# Altium project i.MX6_SoM.PrjPcb
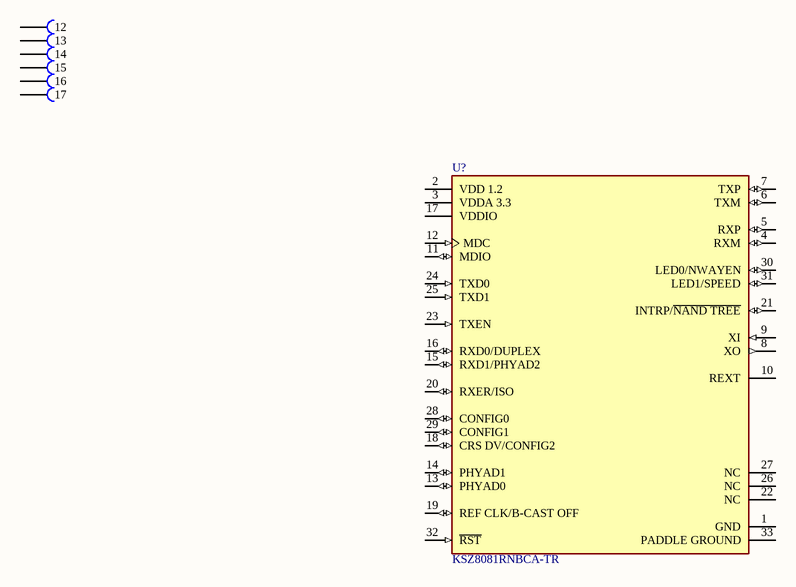
[diagram p0: Ethernet.SchDoc]
6 sheets, 25 parts. Net scope: global (net labels, ports and power ports of the same name join across sheets).
Board files: i.MX6_SoM_BRD.PcbDoc, i.MX6_SoM_PNL.PcbDoc
Sheets:
  Ethernet.SchDoc
  SDRAM.SchDoc
  NAND.SchDoc
  EEPROM.SchDoc
  PMIC.SchDoc
  SUPERVISOR.SchDoc

## Sheet Ethernet.SchDoc
size A4; PageSetup: Record=PageOptions|CenterHorizontal=False|CenterVertical=False|PrintScale=0.95|XCorrection=0.00|YCorrection=0.00|PrintKind=1|BorderSize=5000000|LeftOffset=0|BottomOffset=0|Orientation=1|PaperLength=1000|PaperWidth=1000|Scale=100|PaperSource=15|PrintQuality=600|MediaType=1|DitherType=10|PaperKind=A4|PrintScaleMode=1; Organization: My Company; Address1: Address Line 1; Address2: Address Line 2; Address3: Address Line 3; Address4: Address Line 4; SheetNumber: 1; SheetTotal: 7

### Parts
(Parts that share a designator on the sheet are numbered #1, #2 ... from top to bottom, then left to right.)
i.MX?#1  i.MX6_SoM  [i.MX6_SoM]  (value not drawn)  (part L of 159)  (no BOM)
i.MX?#2  i.MX6_SoM  [i.MX6_SoM]  (value not drawn)  (part M of 159)  (no BOM)
i.MX?#3  i.MX6_SoM  [i.MX6_SoM]  (value not drawn)  (part N of 159)  (no BOM)
i.MX?#4  i.MX6_SoM  [i.MX6_SoM]  (value not drawn)  (part O of 159)  (no BOM)
i.MX?#5  i.MX6_SoM  [i.MX6_SoM]  (value not drawn)  (part P of 159)  (no BOM)
i.MX?#6  i.MX6_SoM  [i.MX6_SoM]  (value not drawn)  (part Q of 159)  (no BOM)
U?#1  KSZ8081RNBCA-TR  [FP-QFN55-32LD-PL-5-MFG]

### Nets

Not connected (* = marked no-connect by the designer): i.MX?#1 12; i.MX?#2 13; i.MX?#3 14; i.MX?#4 15; i.MX?#5 16; i.MX?#6 17; U?#1 1(GND) 2(VDD_1.2) 3(VDDA_3.3) 4(RXM) 5(RXP) 6(TXM) 7(TXP) 8(XO) 9(XI) 10(REXT) 11(MDIO) 12(MDC) 13(PHYAD0) 14(PHYAD1) 15(RXD1/PHYAD2) 16(RXD0/DUPLEX) 17(VDDIO) 18(CRS_DV/CONFIG2) 19(REF_CLK/B-CAST_OFF) 20(RXER/ISO) 21(INTRP/~{NAND_TREE}) 22(NC) 23(TXEN) 24(TXD0) 25(TXD1) 26(NC) 27(NC) 28(CONFIG0) 29(CONFIG1) 30(LED0/NWAYEN) 31(LED1/SPEED) 32(~{RST}) 33(PADDLE_GROUND)

### Notes on the sheet
- Title:
- Author:
- Approved:
- Size:
- Date:
- Git Hash:
- A4
- Prj:
- SW Version:
- Variant:
- Edited:
- CONFIDENTIAL
- File:

### Library data of the parts
U?#1 = CMP-06281-000011-1: IC TRANSCEIVER FULL 1/1 32QFN; Manufacturer: Microchip; Standoff Height: 0mm; Simplex Duplex: Full Duplex; Number Of Channels: 1; Data Rate: 100Mbits/s; Max Supply Voltage: 3.465V; Min Supply Voltage: 1.71V; Nominal Supply Current: 20-47mA; Interface: Ethernet,Other; Max Junction Temp: +125°C; Device Class L2: Interface ICs; Category: IC; Temperature: to +125°C; RoHS: TRUE; Mouser Description: Ethernet ICs 10/100 PHY,  0.11u; Package: QFN55-32LD-PL-5; ComponentLink2URL: http://ww1.microchip.com/downloads/en/DeviceDoc/00002202C.pdf; Digikey Description: IC TRANSCEIVER FULL 1/1 32QFN; Height: 1mm; Lead Free: Yes; Temperature Range High: +125°C; Octopart: https://octopart.com/ksz8081rnbca-tr-microchip-66799962; Device Class L1: Integrated Circuits (ICs); Ambient Temperature Range Low: 0°C; Automotive: No; ComponentLink2Description: Datasheet; Ambient Temperature Range High: +70°C; Device Class L3: Ethernet Interface ICs; Manufacturer Part Number: KSZ8081RNBCA-TR

## Sheet SDRAM.SchDoc
size A4; PageSetup: Record=PageOptions|CenterHorizontal=False|CenterVertical=False|PrintScale=0.95|XCorrection=0.00|YCorrection=0.00|PrintKind=1|BorderSize=5000000|LeftOffset=0|BottomOffset=0|Orientation=1|PaperLength=1000|PaperWidth=1000|Scale=100|PaperSource=15|PrintQuality=600|MediaType=1|DitherType=10|PaperKind=A4|PrintScaleMode=1; Organization: My Company; Address1: Address Line 1; Address2: Address Line 2; Address3: Address Line 3; Address4: Address Line 4; SheetNumber: 3; SheetTotal: 7
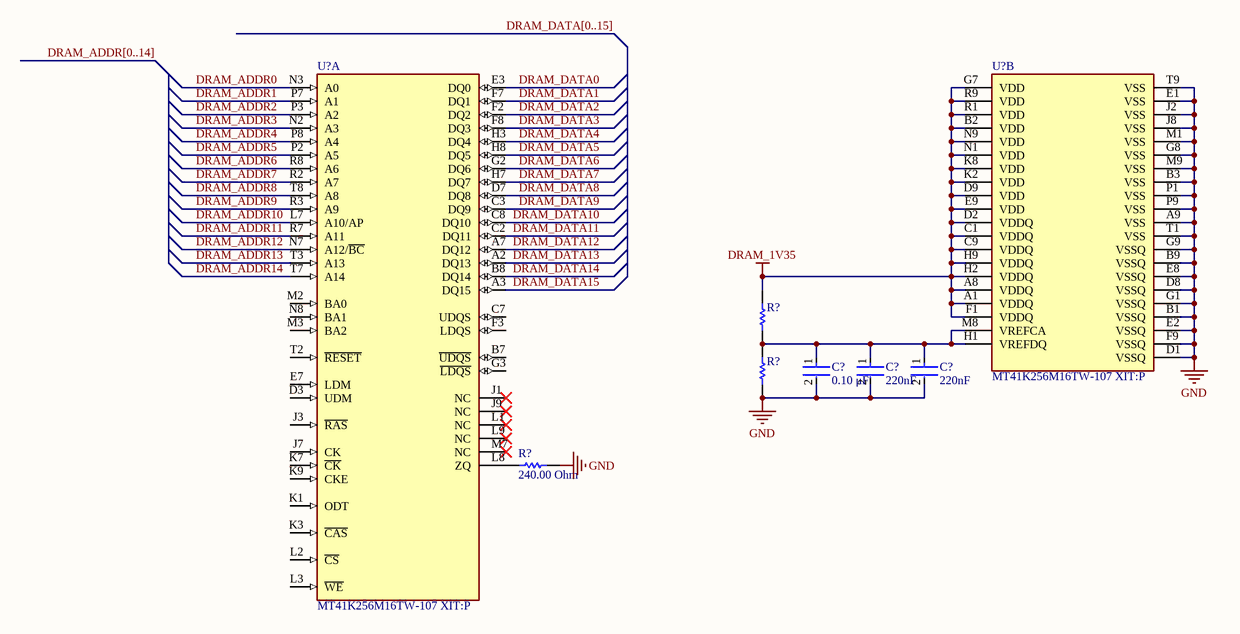
[diagram p1: SDRAM.SchDoc]

### Parts
(Parts that share a designator on the sheet are numbered #1, #2 ... from top to bottom, then left to right.)
C?#1  value 0.10 μF  [FP-C0402-BB-MFG]  (hidden comment: C0402C104K8RACAUTO)
C?#2  Capacitance: 220nF  [FP-CL802-IPC_C]  (hidden comment: CL05B224KP5NNND)
C?#3  Capacitance: 220nF  [FP-CL802-IPC_C]  (hidden comment: CL05B224KP5NNND)
R?#1  RC0402FR-071K5L  [RESC1005X40X25ML05T10]  (value not drawn)
R?#2  RC0402FR-071K5L  [RESC1005X40X25ML05T10]  (value not drawn)
R?#3  value 240.00 Ohm  [RESC0402(1005)_L]  (hidden comment: 240R 1% 0402(1005))
U?#2  MT41K256M16TW-107 XIT:P  [FP-TW-MFG]  (part A of 2)
U?#3  MT41K256M16TW-107 XIT:P  [FP-TW-MFG]  (part B of 2)

### Nets
DRAM_1V35: R?#1.2 U?#3.A1(VDDQ) U?#3.A8(VDDQ) U?#3.B2(VDD) U?#3.C1(VDDQ) U?#3.C9(VDDQ) U?#3.D2(VDDQ) U?#3.D9(VDD) U?#3.E9(VDD) U?#3.F1(VDDQ) U?#3.G7(VDD) U?#3.H2(VDDQ) U?#3.H9(VDDQ) U?#3.K2(VDD) U?#3.K8(VDD) U?#3.N1(VDD) U?#3.N9(VDD) U?#3.R1(VDD) U?#3.R9(VDD)
GND: C?#1.2 C?#2.2 C?#3.2 R?#2.1 R?#3.2 U?#3.A9(VSS) U?#3.B1(VSSQ) U?#3.B3(VSS) U?#3.B9(VSSQ) U?#3.D1(VSSQ) U?#3.D8(VSSQ) U?#3.E1(VSS) U?#3.E2(VSSQ) U?#3.E8(VSSQ) U?#3.F9(VSSQ) U?#3.G1(VSSQ) U?#3.G8(VSS) U?#3.G9(VSSQ) U?#3.J2(VSS) U?#3.J8(VSS) U?#3.M1(VSS) U?#3.M9(VSS) U?#3.P1(VSS) U?#3.P9(VSS) U?#3.T1(VSS) U?#3.T9(VSS)
DRAM_ADDR0: U?#2.N3(A0)
DRAM_ADDR1: U?#2.P7(A1)
DRAM_ADDR2: U?#2.P3(A2)
DRAM_ADDR3: U?#2.N2(A3)
DRAM_ADDR4: U?#2.P8(A4)
DRAM_ADDR5: U?#2.P2(A5)
DRAM_ADDR6: U?#2.R8(A6)
DRAM_ADDR7: U?#2.R2(A7)
DRAM_ADDR8: U?#2.T8(A8)
DRAM_ADDR9: U?#2.R3(A9)
DRAM_ADDR10: U?#2.L7(A10/AP)
DRAM_ADDR11: U?#2.R7(A11)
DRAM_ADDR12: U?#2.N7(A12/~{BC})
DRAM_ADDR13: U?#2.T3(A13)
DRAM_ADDR14: U?#2.T7(A14)
DRAM_DATA0: U?#2.E3(DQ0)
DRAM_DATA1: U?#2.F7(DQ1)
DRAM_DATA2: U?#2.F2(DQ2)
DRAM_DATA3: U?#2.F8(DQ3)
DRAM_DATA4: U?#2.H3(DQ4)
DRAM_DATA5: U?#2.H8(DQ5)
DRAM_DATA6: U?#2.G2(DQ6)
DRAM_DATA7: U?#2.H7(DQ7)
DRAM_DATA8: U?#2.D7(DQ8)
DRAM_DATA9: U?#2.C3(DQ9)
DRAM_DATA10: U?#2.C8(DQ10)
DRAM_DATA11: U?#2.C2(DQ11)
DRAM_DATA12: U?#2.A7(DQ12)
DRAM_DATA13: U?#2.A2(DQ13)
DRAM_DATA14: U?#2.B8(DQ14)
DRAM_DATA15: U?#2.A3(DQ15)
NetC?#1_1: C?#1.1 C?#2.1 C?#3.1 R?#1.1 R?#2.2 U?#3.H1(VREFDQ) U?#3.M8(VREFCA)
NetR?#3_1: R?#3.1 U?#2.L8(ZQ)

Not connected (* = marked no-connect by the designer): U?#2 B7(~{UDQS}) C7(UDQS) D3(UDM) E7(LDM) F3(LDQS) G3(~{LDQS}) J1(NC)* J3(~{RAS}) J7(CK) J9(NC)* K1(ODT) K3(~{CAS}) K7(~{CK}) K9(CKE) L1(NC)* L2(~{CS}) L3(~{WE}) L9(NC)* M2(BA0) M3(BA2) M7(NC)* N8(BA1) T2(~{RESET})

### Buses and harness runs
bus DRAM_ADDR[0..14]
bus DRAM_DATA[0..15]

### Notes on the sheet
- Title:
- Author:
- Approved:
- Size:
- Date:
- Git Hash:
- A4
- Prj:
- SW Version:
- Variant:
- Edited:
- CONFIDENTIAL
- File:

### Library data of the parts
C?#1 = CMP-03020-002733-1: CAP CER 0.1UF 10V X7R 0402; Manufacturer: Kemet; Material: Ceramic; Tolerance: 0.1; Description: C0402 0.10 μF X7R 10.00% 10 V; Temperature Coefficient: 15%; ComponentLink2Description: Datasheet; Automotive: No; Digikey Description: CAP CER 0.1UF 10V X7R 0402; Temperature Range Low: -55°C; Ipc Land Pattern Name: CAPC10050X50; Lead Free: Yes; Category: Cap; Package: C0402-BB; Octopart: https://octopart.com/c0402c104k8racauto-kemet-9145167; Voltage Rating: 10 V; Device Class L2: Capacitors; Capacitance: 0.10 μF; Temperature Range High: +125°C; Height: 0.55mm; ComponentLink2URL: https://content.kemet.com/datasheets/KEM_C1002_X7R_SMD.pdf; Temperature: -55°C to +125°C; Manufacturer Part Number: C0402C104K8RACAUTO; Device Class L1: Passive Components; Temperature Characteristic: X7R; RoHS: TRUE; Device Class L3: Ceramic Capacitors
C?#2 C?#3 = CMP-13271-003770-1: Cap Ceramic 220nF 10V X7R ±10% SMD 0402 +125°C Paper T/R; Radiation Hardening: No; Length: 1mm; Voltage Rating (DC): 10V; Tolerance: 10%; Dielectric: X7R; Depth: 0.5mm; Min Operating Temperature: -55°C; Mount: Surface Mount; Width: 0.02inch; Packaging: Tape and Reel; Case/Package: 0402; Max Operating Temperature: 125°C; Height: 0.5mm; Thickness: 0.022inch; Voltage Rating: 10V; Package Quantity: 50000
R?#1 R?#2 = CMP-2002-07464-1: Manufacturer: Yageo / Phycomp; Part Number: RC0402FR-071K5L
R?#3 = CMP-1011-00438-1: 240R 0.063W 1% 0402 (1005 Metric)  SMD; Case-Metric: 1005; Case-EIA: 0402; Power: 0.063 W; Tolerance: 1 %; Technology: SMT
U?#2 U?#3 = CMP-2000-07474-2: IC DRAM 4GBIT PARALLEL 96FBGA; Data Bus Width: 16b; Address Bus Width: 15b; Operating Supply Voltage: 1.35V; Max Frequency: 933MHz; Density: 4Gb; Memory Type: RAM; Access Time: 1.07ns; RoHS Compliant: Yes; Mount: Surface Mount; Contact Plating: Copper; Interface: Parallel; Case/Package: TFBGA; Frequency: 933MHz; Min Operating Temperature: -40°C; Packaging: Tray; Max Operating Temperature: 95°C; Number of Pins: 96

## Sheet NAND.SchDoc
size A4; PageSetup: Record=PageOptions|CenterHorizontal=False|CenterVertical=False|PrintScale=0.95|XCorrection=0.00|YCorrection=0.00|PrintKind=1|BorderSize=5000000|LeftOffset=0|BottomOffset=0|Orientation=1|PaperLength=1000|PaperWidth=1000|Scale=100|PaperSource=15|PrintQuality=600|MediaType=1|DitherType=10|PaperKind=A4|PrintScaleMode=1; Organization: My Company; Address1: Address Line 1; Address2: Address Line 2; Address3: Address Line 3; Address4: Address Line 4; SheetNumber: 4; SheetTotal: 6
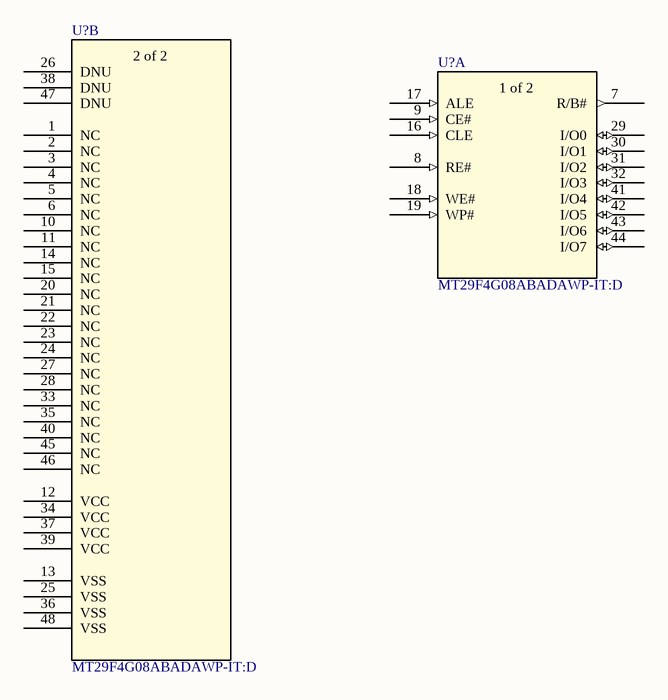
[diagram p2: NAND.SchDoc]

### Parts
(Parts that share a designator on the sheet are numbered #1, #2 ... from top to bottom, then left to right.)
U?#4  MT29F4G08ABADAWP-IT:D  [TSOP48_TYPE1_CPL_MRN]  (part B of 2)
U?#5  MT29F4G08ABADAWP-IT:D  [TSOP48_TYPE1_CPL_MRN]  (part A of 2)

### Nets

Not connected (* = marked no-connect by the designer): U?#4 1(NC) 2(NC) 3(NC) 4(NC) 5(NC) 6(NC) 10(NC) 11(NC) 12(VCC) 13(VSS) 14(NC) 15(NC) 20(NC) 21(NC) 22(NC) 23(NC) 24(NC) 25(VSS) 26(DNU) 27(NC) 28(NC) 33(NC) 34(VCC) 35(NC) 36(VSS) 37(VCC) 38(DNU) 39(VCC) 40(NC) 45(NC) 46(NC) 47(DNU) 48(VSS); U?#5 7(R/B#) 8(RE#) 9(CE#) 16(CLE) 17(ALE) 18(WE#) 19(WP#) 29(I/O0) 30(I/O1) 31(I/O2) 32(I/O3) 41(I/O4) 42(I/O5) 43(I/O6) 44(I/O7)

### Notes on the sheet
- Title:
- Author:
- Approved:
- Size:
- Date:
- Git Hash:
- A4
- Prj:
- SW Version:
- Variant:
- Edited:
- CONFIDENTIAL
- File:
- (in symbol MT29F4G08ABADAWP-IT:D, part A) 1 of 2
- (in symbol MT29F4G08ABADAWP-IT:D, part B) 2 of 2

### Library data of the parts
U?#4 U?#5 = MT29F4G08ABADAWP-IT:D: No Description Available; SourceLibrary: Add_to_database_2020-12-08; Built_By: EMA_Cory; Vendor: Micron; Datasheet: https://www.mouser.com/datasheet/2/671/micron_technology_micts06228-1-1759217.pdf; Copyright: Copyright (C) 2018 Accelerated Designs. All rights reserved; Manufacturer_Part_Number: MT29F4G08ABADAWP-IT:D; RefDes: RefDes; Type: DEV

## Sheet EEPROM.SchDoc
size A4; PageSetup: Record=PageOptions|CenterHorizontal=False|CenterVertical=False|PrintScale=0.95|XCorrection=0.00|YCorrection=0.00|PrintKind=1|BorderSize=5000000|LeftOffset=0|BottomOffset=0|Orientation=1|PaperLength=1000|PaperWidth=1000|Scale=100|PaperSource=15|PrintQuality=600|MediaType=1|DitherType=10|PaperKind=A4|PrintScaleMode=1; Organization: My Company; Address1: Address Line 1; Address2: Address Line 2; Address3: Address Line 3; Address4: Address Line 4; SheetNumber: 5; SheetTotal: 6
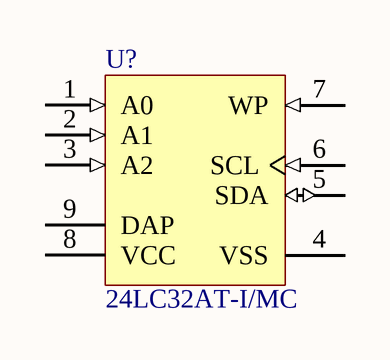
[diagram p3: EEPROM.SchDoc]

### Parts
(Parts that share a designator on the sheet are numbered #1, #2 ... from top to bottom, then left to right.)
U?#6  24LC32AT-I/MC  [DFN-MC8]

### Nets

Not connected (* = marked no-connect by the designer): U?#6 1(A0) 2(A1) 3(A2) 4(VSS) 5(SDA) 6(SCL) 7(WP) 8(VCC) 9(DAP)

### Notes on the sheet
- Title:
- Author:
- Approved:
- Size:
- Date:
- Git Hash:
- A4
- Prj:
- SW Version:
- Variant:
- Edited:
- CONFIDENTIAL
- File:

### Library data of the parts
U?#6 = CMP-0159-00432-1: 32Kbit, 400kHz, 2.5V, I2C Serial EEPROM, 8-Pin DFN, Industrial Temperature, Tape and Reel; DatasheetVersion: revJ, Feb-2009; PackageDescription: 8-Lead Plastic Dual Flat, No Lead Package (MC) - 2x3x0.9mm Body [DFN]; PackageVersion: revBB, Aug-2009; PackageReference: DFN-MC8

## Sheet PMIC.SchDoc
size A4; Organization: My Company; Address1: Address Line 1; Address2: Address Line 2; Address3: Address Line 3; Address4: Address Line 4; SheetNumber: 6; SheetTotal: 7
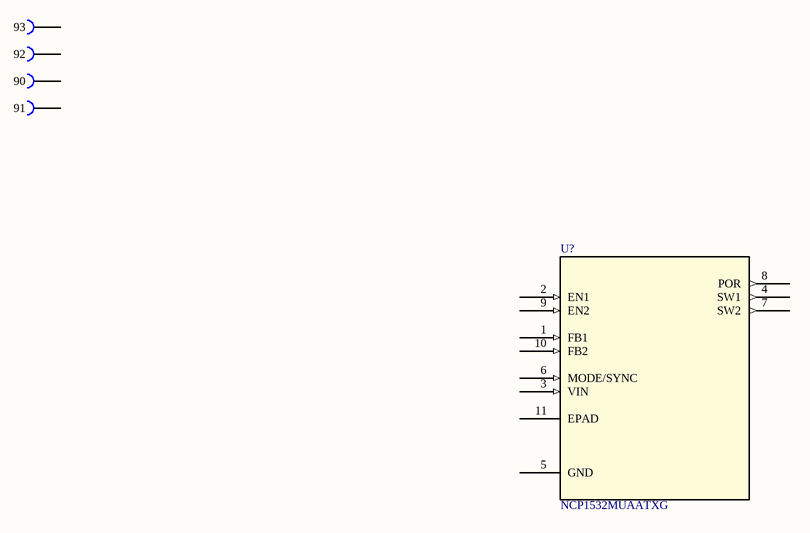
[diagram p4: PMIC.SchDoc]

### Parts
(Parts that share a designator on the sheet are numbered #1, #2 ... from top to bottom, then left to right.)
i.MX?#7  i.MX6_SoM  [i.MX6_SoM]  (value not drawn)  (part 93 of 159)  (no BOM)
i.MX?#8  i.MX6_SoM  [i.MX6_SoM]  (value not drawn)  (part 92 of 159)  (no BOM)
i.MX?#9  i.MX6_SoM  [i.MX6_SoM]  (value not drawn)  (part 90 of 159)  (no BOM)
i.MX?#10  i.MX6_SoM  [i.MX6_SoM]  (value not drawn)  (part 91 of 159)  (no BOM)
U?#7  NCP1532MUAATXG  [UDFN10_3X3_ONS]

### Nets

Not connected (* = marked no-connect by the designer): i.MX?#7 93; i.MX?#8 92; i.MX?#9 90; i.MX?#10 91; U?#7 1(FB1) 2(EN1) 3(VIN) 4(SW1) 5(GND) 6(MODE/SYNC) 7(SW2) 8(POR) 9(EN2) 10(FB2) 11(EPAD)

### Notes on the sheet
- Title:
- Author:
- Approved:
- Size:
- Date:
- Git Hash:
- A4
- Prj:
- SW Version:
- Variant:
- Edited:
- CONFIDENTIAL
- File:

### Library data of the parts
U?#7 = NCP1532MUAATXG: No Description Available; SourceLibrary: ON_Semiconductor_2018-03-21; Built_By: EMA_Jessica; Vendor: ON Semiconductor; Copyright: Copyright (C) 2016 Accelerated Designs. All rights reserved; Manufacturer_Part_Number: NCP1532MUAATXG; RefDes: RefDes; Type: DEV

## Sheet SUPERVISOR.SchDoc
size A4; Organization: My Company; Address1: Address Line 1; Address2: Address Line 2; Address3: Address Line 3; Address4: Address Line 4; SheetNumber: 7; SheetTotal: 7
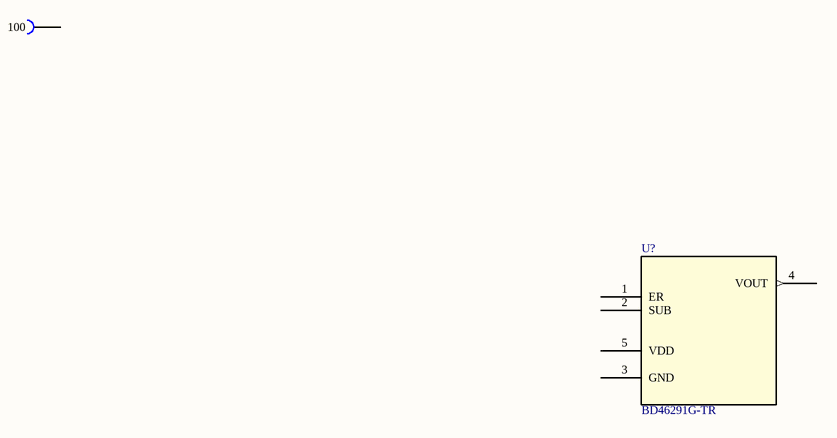
[diagram p5: SUPERVISOR.SchDoc]

### Parts
(Parts that share a designator on the sheet are numbered #1, #2 ... from top to bottom, then left to right.)
i.MX?#11  i.MX6_SoM  [i.MX6_SoM]  (value not drawn)  (part 100 of 159)  (no BOM)
U?#8  BD46291G-TR  [SSOP5_ROM]

### Nets

Not connected (* = marked no-connect by the designer): i.MX?#11 100; U?#8 1(ER) 2(SUB) 3(GND) 4(VOUT) 5(VDD)

### Notes on the sheet
- Title:
- Author:
- Approved:
- Size:
- Date:
- Git Hash:
- A4
- Prj:
- SW Version:
- Variant:
- Edited:
- CONFIDENTIAL
- File:

### Library data of the parts
U?#8 = BD46291G-TR: No Description Available; SourceLibrary: ROHM_2019-10-21; Built_By: EMA_Molly; Vendor: ROHM Semiconductor; Copyright: Copyright (C) 2018 Accelerated Designs. All rights reserved; Manufacturer_Part_Number: BD46291G-TR; RefDes: RefDes; Type: DEV